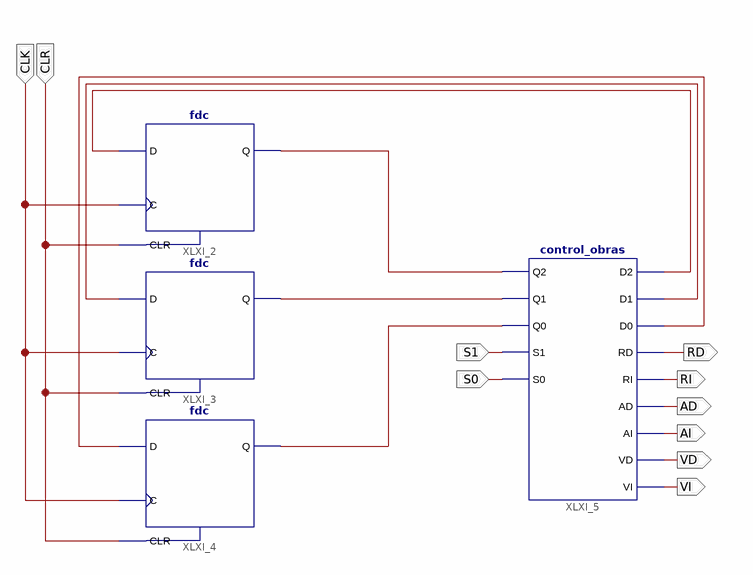
[diagram p0: schematic sheet 1]
// Xilinx ISE schematic p4ej1.sch (spartan3) as structural Verilog: 4 symbols, 10 ports
module p4ej1 (
  input  CLR,
  input  CLK,
  input  S1,
  input  S0,
  output RD,
  output RI,
  output AD,
  output AI,
  output VD,
  output VI
);

  wire XLXN_52, XLXN_53, XLXN_54, XLXN_55, XLXN_56, XLXN_57;

  fdc XLXI_2 (.C(CLK), .CLR(CLR), .D(XLXN_52), .Q(XLXN_55));
  fdc XLXI_3 (.C(CLK), .CLR(CLR), .D(XLXN_53), .Q(XLXN_56));
  fdc XLXI_4 (.C(CLK), .CLR(CLR), .D(XLXN_54), .Q(XLXN_57));
  control_obras XLXI_5 (
    .AD(AD), .AI(AI), .D0(XLXN_54), .D1(XLXN_53), .D2(XLXN_52), .Q0(XLXN_57), .Q1(XLXN_56), .Q2(XLXN_55),
    .RD(RD), .RI(RI), .S0(S0), .S1(S1), .VD(VD), .VI(VI));
endmodule
